# EAGLE design pomodoro (EAGLE 9.6.2)
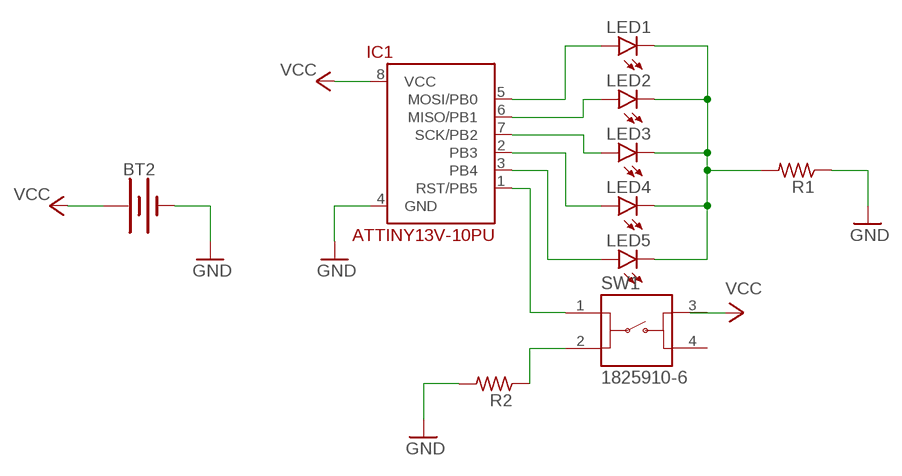
[diagram p0: schematic, sheet 1]

## Parts
BT2  BATTERY-20MM_PTH_KIT  [BATTCOM_20MM_PTH_KIT]
IC1  ATTINY13V-10PU  [DIL08]
LED1  LED3MM  [LED3MM]
LED2  LED3MM  [LED3MM]
LED3  LED3MM  [LED3MM]
LED4  LED3MM  [LED3MM]
LED5  LED3MM  [LED3MM]
R1  R-US_0204/7  [0204/7]
R2  R-US_0204/7  [0204/7]
SW1  1825910-6  [1825910-6]

## Nets
GND: BT2.2(-) IC1.4(GND) R1.1 R2.2
N$1: IC1.5(MOSI/PB0) LED1.A
N$2: IC1.6(MISO/PB1) LED2.A
N$3: IC1.7(SCK/PB2) LED3.A
N$4: IC1.2(PB3) LED4.A
N$5: IC1.3(PB4) LED5.A
N$6: LED1.K(C) LED2.K(C) LED3.K(C) LED4.K(C) LED5.K(C) R1.2
N$7: IC1.1(RST/PB5) SW1.1
N$8: R2.1 SW1.2
VCC: BT2.1(+) IC1.8(VCC) SW1.3
Unconnected: SW1.4

## Library data of the parts
BT2 = SparkFun-Batteries:BATTERY: Battery - Single Cell A variety of battery chemistries, sizes, and footprints. Device List: 20MM_PTH - Coin Cell Battery Holder - 20mm (PTH) <https://www.sparkfun.com/products/783> 20MM_PTH_KIT- Coin Cell battery Holder - 20 mm (PTH) <http://www.sparkfun.com/products/783>kit version with special mask 6.8MM_PTH - Coin Cell Battery Holder - 6.8MM(SMD) <https://www.digikey.com/product-detail/en/seiko-instruments/MS621FE-FL11E/728-1057-ND/1889208?WT.srch=1&gclid=CNOQ5a6LzdQCFZS2wAodXCkE0g> 12MM_SMD - Coin Cell Battery Holder - 12mm (SMD) <https://www.sparkfun.com/products/10592> 12MM_PTH - Coin Cell Battery Holder - 12mm (PTH) <https://www.sparkfun.com/products/7948> 20MM_SMD - 20mm Coin Cell Battery Holder (SMD) (2 legs) Used on the Big Time Watch Kit <https://www.sparkfun.com/products/11734> 20MM_SMD_4LEGS - Coin Cell Battery Holder - 20mm (SMD) <https://www.sparkfun.com/products/11892> 20MM_SMD_4LEGS_OVERPASTE - Coin Cell Battery Holder - 20mm (SMD) <https://www.sparkfun.com/products/11892> (Over-paste on the legs) 24.5MM_PTH - Coin Cell Battery Holder - 24.5mm (PTH) <https://www.sparkfun.com/products/8863> 9V - 9V Battery Holder - PC Mount Used on the SparkFun SparkPunk Sound Kit <https://www.sparkfun.com/products/11177> and SparkFun SparkPunk Sequencer Kit <https://www.sparkfun.com/products/12707> 18650 - Battery Holder - 18650 (PTH) <https://www.sparkfun.com/products/13113> AA - Battery Holder - 1xAA (PTH) <https://www.sparkfun.com/products/7949> AAA - Battery Holder - 1xAAA (PTH) <https://www.sparkfun.com/products/12718> AA_KIT - Battery Holder - 1xAA (PTH) <https://www.sparkfun.com/products/7949> Special kit package - pads only have exposed copper on one side of the board. AAA_KIT - Battery Holder - 1xAAA (PTH) <https://www.sparkfun.com/products/12718> Special kit package - pads only have exposed copper on one side of the board.; PROD_ID: 9031
IC1 = attiny13:ATTINY13V-10*
LED1-LED5 = led:LED: LED OSRAM: - CHIPLED LG R971, LG N971, LY N971, LG Q971, LY Q971, LO R971, LY R971 LH N974, LH R974 LS Q976, LO Q976, LY Q976 LO Q996 - Hyper CHIPLED LW Q18S LB Q993, LB Q99A, LB R99A - SideLED LS A670, LO A670, LY A670, LG A670, LP A670 LB A673, LV A673, LT A673, LW A673 LH A674 LY A675 LS A676, LA A676, LO A676, LY A676, LW A676 LS A679, LY A679, LG A679 - Hyper Micro SIDELED® LS Y876, LA Y876, LO Y876, LY Y876 LT Y87S - SmartLED LW L88C, LW L88S LB L89C, LB L89S, LG L890 LS L89K, LO L89K, LY L89K LS L896, LA L896, LO L896, LY L896 - TOPLED LS T670, LO T670, LY T670, LG T670, LP T670 LSG T670, LSP T670, LSY T670, LOP T670, LYG T670 LG T671, LOG T671, LSG T671 LB T673, LV T673, LT T673, LW T673 LH T674 LS T676, LA T676, LO T676, LY T676, LB T676, LH T676, LSB T676, LW T676 LB T67C, LV T67C, LT T67C, LS T67K, LO T67K, LY T67K, LW E67C LS E67B, LA E67B, LO E67B, LY E67B, LB E67C, LV E67C, LT E67C LW T67C LS T679, LY T679, LG T679 LS T770, LO T770, LY T770, LG T770, LP T770 LB T773, LV T773, LT T773, LW T773 LH T774 LS E675, LA E675, LY E675, LS T675 LS T776, LA T776, LO T776, LY T776, LB T776 LHGB T686 LT T68C, LB T68C - Hyper Mini TOPLED® LB M676 - Mini TOPLED Santana® LG M470 LS M47K, LO M47K, LY M47K Source: http://www.osram.convergy.de LUXEON: - LUMILED® LXK2-PW12-R00, LXK2-PW12-S00, LXK2-PW14-U00, LXK2-PW14-V00 LXK2-PM12-R00, LXK2-PM12-S00, LXK2-PM14-U00 LXK2-PE12-Q00, LXK2-PE12-R00, LXK2-PE12-S00, LXK2-PE14-T00, LXK2-PE14-U00 LXK2-PB12-K00, LXK2-PB12-L00, LXK2-PB12-M00, LXK2-PB14-N00, LXK2-PB14-P00, LXK2-PB14-Q00 LXK2-PR12-L00, LXK2-PR12-M00, LXK2-PR14-Q00, LXK2-PR14-R00 LXK2-PD12-Q00, LXK2-PD12-R00, LXK2-PD12-S00 LXK2-PH12-R00, LXK2-PH12-S00 LXK2-PL12-P00, LXK2-PL12-Q00, LXK2-PL12-R00 Source: www.luxeon.com KINGBRIGHT: KA-3528ASYC Source: www.kingbright.com
R1 R2 = rcl:R-US_: RESISTOR, American symbol; SPICEPREFIX: R
SW1 = Switch:1825910-6: SWITCH TACTILE SPST-NO 0.05A 24V Manufacturer's datasheet <https://www.te.com/commerce/DocumentDelivery/DDEController?Action=srchrtrv&DocNm=1825910&DocType=Customer+Drawing&DocLang=English>; CREATED_BY: PCBLayout.com; DIGIKEY_PART_NUMBER: 450-1650-ND; MANUFACTURER: TE Connectivity ALCOSWITCH Switches; MPN: 1825910-6

## Board
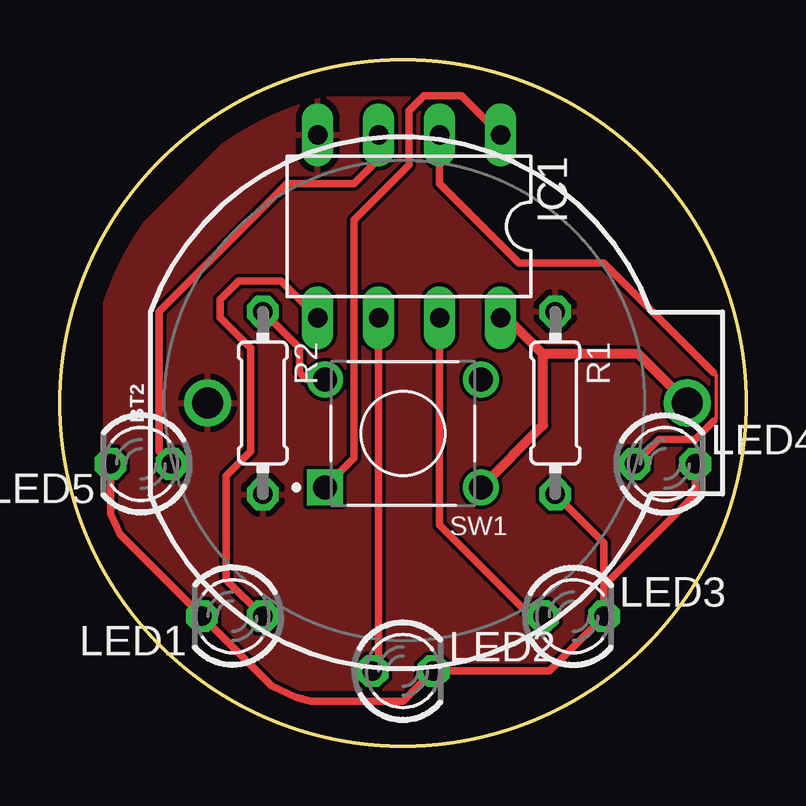
[diagram p1: board, top side]
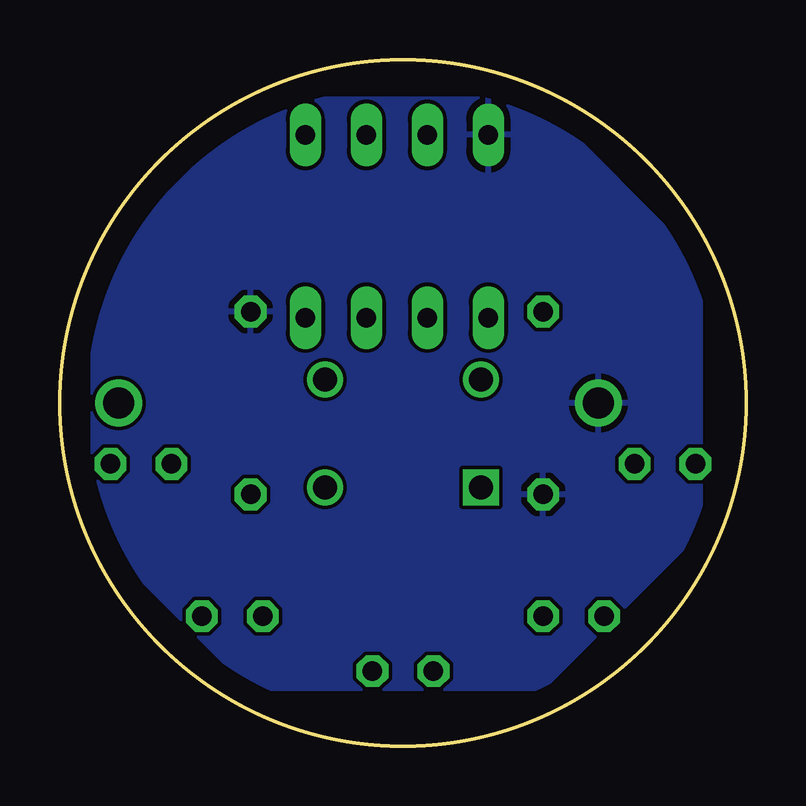
[diagram p2: board, bottom side, seen from below]

Size 28.6 x 28.6 mm. Coordinates in mm from the lower left corner, seen from the top.
Outline: circle at 14.3,14.3 radius 14.3
Copper layers (1*16): Top 0.035mm / dielectric 1.5mm / Bottom 0.035mm
Design rules "default": minimum track width 6mil, minimum drill 0.35mm, track to track 6mil, track to pad 6mil, pad to pad 6mil, via to via 6mil, smd to smd 6mil, copper to edge 40mil, drill to drill 6mil, minimum pad ring 10mil, minimum via ring 8mil, stop-mask expansion 4mil, vias tented up to drill 0mil, thermal gap 10mil

### Footprints (pad centres in the part's own frame; a part is rotated, then mirrored left to right if it is on the bottom)
BATTCOM_20MM_PTH_KIT = drill 1.3: 1 11.85,0; 2 -8.15,0
DIL08 = drill 0.813 long: 1 -3.81,-3.81; 2 -1.27,-3.81; 3 1.27,-3.81; 4 3.81,-3.81; 5 3.81,3.81; 6 1.27,3.81; 7 -1.27,3.81; 8 -3.81,3.81
LED3MM = drill 0.813 octagon: A -1.27,0; K 1.27,0
0204/7 = drill 0.813 octagon: 1 -3.81,0; 2 3.81,0
1825910-6 = drill 0.99 square: 1 3.25,2.25 | drill 0.99: 2 3.25,-2.25; 3 -3.25,2.25; 4 -3.25,-2.25

### Placement (x,y rotation side)
BT2  14.3,14.3 0 top
IC1  14.55,21.67 180 top
LED1  7.19,5.41 180 top
LED2  14.3,3.12 0 top
LED3  21.41,5.41 0 top
LED4  25.22,11.76 0 top
LED5  3.38,11.76 180 top
R1  20.65,14.3 270 top
R2  8.46,14.3 270 top
SW1  14.3,13.03 180 top

### Tracks (layer width: path | path; a pad name or v marks a point on that pad's centre or on a via)
GND
  pour Top: 1.85,20.14 1.85,8.97 8.46,2.36 20.65,2.36 27.25,8.97 27.25,19.89 20.14,27 8.71,27
  pour Bottom: 1.85,20.14 1.85,8.97 8.46,2.36 20.65,2.36 27.25,8.97 27.25,19.89 20.14,27 8.71,27
N$1
  Top 0.305: IC1.5 9.22,19.38 7.44,19.38 6.68,18.62 6.68,17.86 7.95,16.59 7.95,12.27 6.93,11.25 6.93,6.93 LED1.A
N$2
  Top 0.305: IC1.6 13.28,3.38 LED2.A
N$3
  Top 0.305: IC1.7 15.82,9.22 19.63,5.41 LED3.A
N$4
  Top 0.152: 27.24,15.58 27.35,15.47 27.35,13.64 27.25,13.54
  Top 0.305: 27.24,15.58 22.68,20.14 19.13,20.14 15.82,23.44 IC1.2 | LED4.A 24.97,12.78 26.49,12.78 27.25,13.54
N$5
  Top 0.305: LED5.A 4.14,12.27 4.14,18.11 9.47,23.44 12.27,23.44 13.28,24.46 IC1.3
N$6
  Top 0.305: LED4.K 26.49,10.49 22.68,6.68 | 22.68,6.68 22.68,6.17 LED3.K 20.4,3.12 LED2.K 14.3,1.85 10.5,1.85 9.83,2.03 8.83,2.5 LED1.K 2.5,8.83 2.11,9.67 LED5.K | R1.2 22.68,8.46 22.68,6.68
N$7
  Top 0.305: SW1.1 12.27,12 12.27,21.92 14.55,24.21 14.55,26.49 14.56,26.49 15.17,27.1 16.74,27.1 IC1.1 18.36,25.98
N$8
  Top 0.305: R2.1 9.98,16.59 9.98,15.57 10.27,15.28 SW1.2
VCC
  Top 0.406: BT2.1 24.12,16.33 20.14,16.33 | 20.14,16.33 18.62,17.86 IC1.8 | SW1.3 20.14,13.37 20.14,16.33